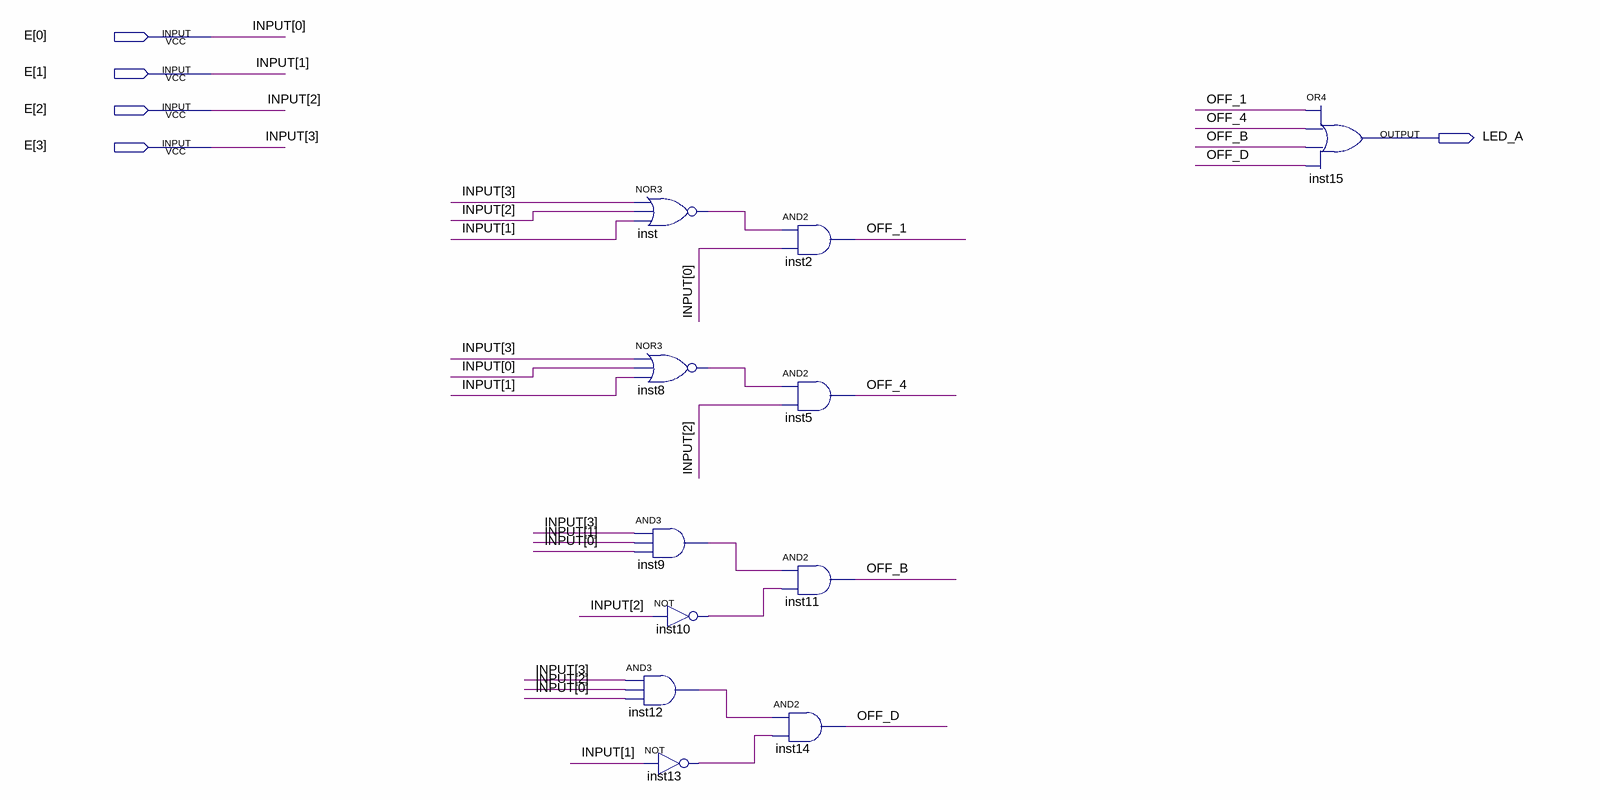
[diagram p0: schematic sheet]
// Quartus schematic A.bdf as structural Verilog: 11 symbols, 5 pins
module A (
  input  [3:0] E,
  output LED_A
);

  wire inst8_out, inst9_out, inst10_out, inst12_out, inst13_out, inst_out, OFF_1, OFF_4, OFF_B, OFF_D;

  nor inst (inst_out, E[3], E[2], E[1]);
  nor inst8 (inst8_out, E[3], E[0], E[1]);
  and inst9 (inst9_out, E[3], E[1], E[0]);
  not inst10 (inst10_out, E[2]);
  and inst12 (inst12_out, E[3], E[2], E[0]);
  not inst13 (inst13_out, E[1]);
  and inst2 (OFF_1, inst_out, E[0]);
  and inst5 (OFF_4, inst8_out, E[2]);
  and inst11 (OFF_B, inst9_out, inst10_out);
  and inst14 (OFF_D, inst12_out, inst13_out);
  or inst15 (LED_A, OFF_1, OFF_4, OFF_B, OFF_D);

  // Other names for the same wires on the sheet: INPUT[3:0] = E
endmodule
